# Altium schematic sheet BRAWN.SchDoc: Top Level
size A3; CompanyName: NOT USED; SheetNumber: 0; SheetTotal: 0; PageSetup: Record=PageOptions|CenterHorizontal=True|CenterVertical=True|PrintScale=1.00|XCorrection=1.00|YCorrection=1.00|PrintKind=0|BorderSize=5000000|LeftOffset=0|BottomOffset=0|Orientation=2|PaperLength=1000|PaperWidth=1000|Scale=100|PaperSource=7|PrintQuality=-4|MediaType=1|DitherType=10|PaperKind=A3|PrintScaleMode=0
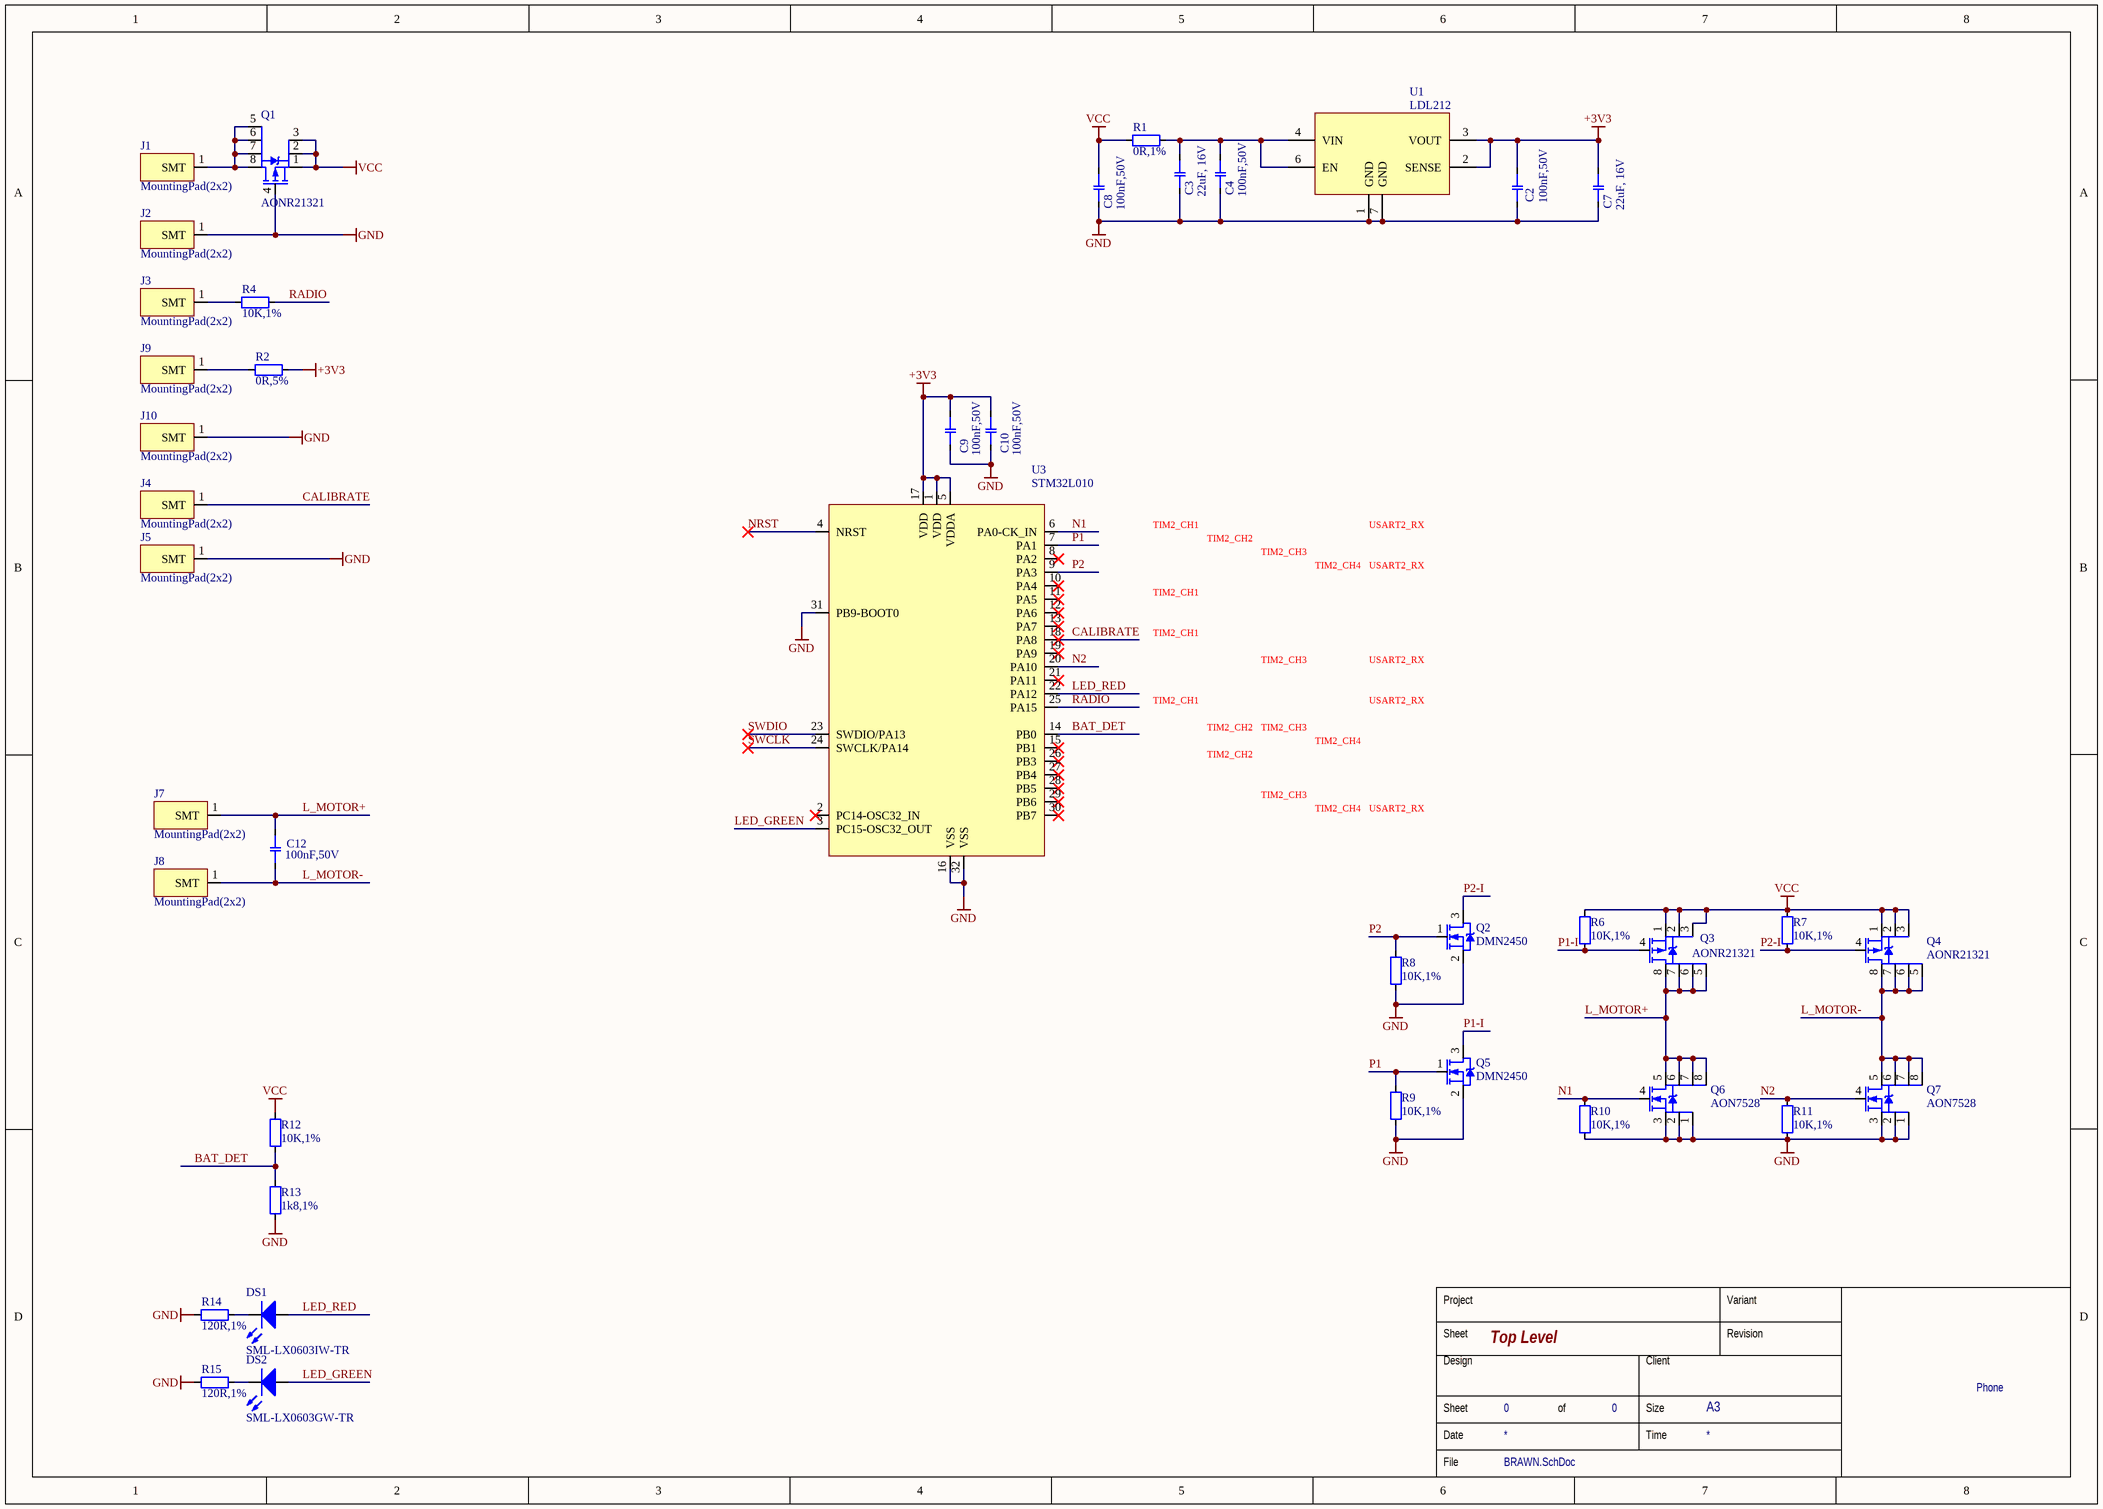
[diagram p0: BRAWN.SchDoc]

## Parts
C2  100nF,50V  [CAPC1005X05N_0402]
C3  22uF, 16V  [CAPC2012X12N_0805]
C4  100nF,50V  [CAPC1005X05N_0402]
C7  22uF, 16V  [CAPC2012X12N_0805]
C8  100nF,50V  [CAPC1005X05N_0402]
C9  100nF,50V  [CAPC1005X05N_0402]
C10  100nF,50V  [CAPC1005X05N_0402]
C12  100nF,50V  [CAPC1005X05N_0402]
DS1  SML-LX0603IW-TR  [LED_SML-LX0603]
DS2  SML-LX0603GW-TR  [LED_SML-LX0603]
J1  MountingPad(2x2)  [MountingPad(2x2)]
J2  MountingPad(2x2)  [MountingPad(2x2)]
J3  MountingPad(2x2)  [MountingPad(2x2)]
J4  MountingPad(2x2)  [MountingPad(2x2)]
J5  MountingPad(2x2)  [MountingPad(2x2)]
J7  MountingPad(2x2)  [MountingPad(2x2)]
J8  MountingPad(2x2)  [MountingPad(2x2)]
J9  MountingPad(2x2)  [MountingPad(2x2)]
J10  MountingPad(2x2)  [MountingPad(2x2)]
Q1  AONR21321  [DFN3X3A_8L_EP1_P]
Q2  DMN2450  [DFN3-125x125x53]
Q3  AONR21321  [DFN3X3A_8L_EP1_P]
Q4  AONR21321  [DFN3X3A_8L_EP1_P]
Q5  DMN2450  [DFN3-125x125x53]
Q6  AON7528  [DFN3X3A_8L_EP1_P]
Q7  AON7528  [DFN3X3A_8L_EP1_P]
R1  0R,1%  [RESC1005X04N_0402]
R2  0R,5%  [RESC1608X06N_0603]
R4  10K,1%  [RESC1005X04N_0402]
R6  10K,1%  [RESC1005X04N_0402]
R7  10K,1%  [RESC1005X04N_0402]
R8  10K,1%  [RESC1005X04N_0402]
R9  10K,1%  [RESC1005X04N_0402]
R10  10K,1%  [RESC1005X04N_0402]
R11  10K,1%  [RESC1005X04N_0402]
R12  10K,1%  [RESC1005X04N_0402]
R13  1k8,1%  [RESC1005X04N_0402]
R14  120R,1%  [RESC1005X04N_0402]
R15  120R,1%  [RESC1005X04N_0402]
U1  LDL212  [DFN50P200X200X80-8N_PWSON6]
U3  STM32L010  [TSQFP50P700X700X160-32N]

## Nets
+3V3: C2.2 C7.2 C9.2 C10.2 R2.2 U1.2(SENSE) U1.3(VOUT) U3.1(VDD) U3.5(VDDA) U3.17(VDD)
GND: C2.1 C3.1 C4.1 C7.1 C8.1 C9.1 C10.1 J2.1(SMT) J5.1(SMT) J10.1(SMT) Q1.4(G) Q2.2(S) Q5.2(S) Q6.1(S) Q6.2(S) Q6.3(S) Q7.1(S) Q7.2(S) Q7.3(S) R8.2 R9.2 R10.2 R11.2 R13.2 R14.1 R15.1 U1.1(GND) U1.7(GND) U3.16(VSS) U3.31(PB9-BOOT0) U3.32(VSS)
VCC: C8.2 Q1.1(S) Q1.2(S) Q1.3(S) Q3.1(S) Q3.2(S) Q3.3(S) Q4.1(S) Q4.2(S) Q4.3(S) R1.1 R6.1 R7.1 R12.1
BAT_DET: R12.2 R13.1 U3.14(PB0)
CALIBRATE: J4.1(SMT) U3.18(PA8)
L_MOTOR+: C12.2 J7.1(SMT) Q3.5(D) Q3.6(D) Q3.7(D) Q3.8(D) Q6.5(D) Q6.6(D) Q6.7(D) Q6.8(D)
L_MOTOR-: C12.1 J8.1(SMT) Q4.5(D) Q4.6(D) Q4.7(D) Q4.8(D) Q7.5(D) Q7.6(D) Q7.7(D) Q7.8(D)
LED_GREEN: DS2.2(A) U3.3(PC15-OSC32_OUT)
LED_RED: DS1.2(A) U3.22(PA12)
N1: Q6.4(G) R10.1 U3.6(PA0-CK_IN)
N2: Q7.4(G) R11.1 U3.20(PA10)
NRST: U3.4(NRST)
P1: Q5.1(G) R9.1 U3.7(PA1)
P1-I: Q3.4(G) Q5.3(D) R6.2
P2: Q2.1(G) R8.1 U3.9(PA3)
P2-I: Q2.3(D) Q4.4(G) R7.2
RADIO: R4.2 U3.25(PA15)
SWCLK: U3.24(SWCLK/PA14)
SWDIO: U3.23(SWDIO/PA13)
NetC3_2: C3.2 C4.2 R1.2 U1.4(VIN) U1.6(EN)
NetDS1_1: DS1.1(C) R14.2
NetDS2_1: DS2.1(C) R15.2
NetJ1_1: J1.1(SMT) Q1.5(D) Q1.6(D) Q1.7(D) Q1.8(D)
NetJ3_1: J3.1(SMT) R4.1
NetJ9_1: J9.1(SMT) R2.1

Not connected (* = marked no-connect by the designer): U3 2(PC14-OSC32_IN)* 8(PA2)* 10(PA4)* 11(PA5)* 12(PA6)* 13(PA7)* 15(PB1)* 19(PA9)* 21(PA11)* 26(PB3)* 27(PB4)* 28(PB5)* 29(PB6)* 30(PB7)*

## Notes on the sheet
- TIM2_CH1
- TIM2_CH2
- TIM2_CH3
- TIM2_CH4
- USART2_RX
- Project
- Variant
- Sheet
- Design
- Client
- Revision
- Phone
- Date
- of
- Size
- Time
- A3
- File

## Library data of the parts
C2 C4 C8-C10 C12 = CCG-104CE-G: CAP CER 100nF 50V X7R 0402; Manufacturer: Taiyo Yuden; Manufacturer Part Number: UMK105B7104KV-FR; Tolerance: 10%; Type: Ceramic; Display_Name: 100nF,50V; Capacitance: 100nF; Dielectric: X7R; Voltage: 50V; BWA PN: CCG-104CE-G; Schematic Symbol: CAP-NP_1; Supplier 1: Digi-Key; Supplier Part Number 1: 587-3498-1-ND
C3 C7 = CCI-226DE-G: CAP CER 22UF 16V X5R 0805; Manufacturer: Samsung Electro-Mechanics; Manufacturer Part Number: CL21A226KOQNNNE; Tolerance: 10%; Type: Ceramic; Display_Name: 22uF, 16V; Capacitance: 22uF; Dielectric: X5R; Voltage: 16V; BWA PN: CCI-226DE-G; Schematic Symbol: CAP-NP_1; Supplier 1: Digi-Key; Supplier Part Number 1: 1276-6526-1-ND
DS1 = LED-10056-A: LED 635NM RED DIFF 0603 SMD; Manufacturer: Lumex Opto/Components Inc; Axial Intensity: 14mcd; If(max): 20mA; Lens type: Diffused, White; Lens Style/Size: Rectangle, 1mmx0.8mm; Vf@I: 2V; Viewing Angle: 160deg; Vr(max): 5V; Display_Name: SML-LX0603IW-TR; Wavelength: 635nm; BWA PN: LED-10056-A; Colour: Red; Schematic Symbol: LED_1; Manufacturer Part Number: SML-LX0603IW-TR; Supplier 1: Digi-Key; Supplier Part Number 1: 67-1548-1-ND
DS2 = LED-10011-A: LED 565NM GRN DIFF 0603 SMD; Manufacturer: Lumex Opto/Components Inc; Axial Intensity: 18mcd; Colour: Green; If(max): 25mA; Lens type: Diffused, White; Lens Style/Size: Rectangle, 1mmx0.8mm; Vf@I: 2.2V; Viewing Angle: 160deg; Vr(max): 5V; Display_Name: SML-LX0603GW-TR; Wavelength: 565nm; BWA PN: LED-10011-A; Schematic Symbol: LED_1; Manufacturer Part Number: SML-LX0603GW-TR; Supplier 1: Digi-Key; Supplier Part Number 1: 67-1549-1-ND
Q1 Q3 Q4 = TRN-10126-A: P-Channel 30 V 24A (Tc) 4.1W (Ta), 24W (Tc) Surface Mount 8-DFN-EP (3x3); Manufacturer: Alpha & Omega Semiconductor Inc.; Type: P; rds(on): 16.5mOhm @ 12A, 10V; Vds(max): 30V; Vgs(max): ±25V; Vth(max): 2.3V @ 250µA; Display_Name: AONR21321; BWA PN: TRN-10126-A; Id(max): 24A; Schematic Symbol: MOSFET-P_5; Manufacturer Part Number: AONR21321; Supplier 1: Digi-Key; Supplier Part Number 1: 785-1797-1-ND
Q2 Q5 = TRN-10128-P: MOSFET N-CH 20V 900MA 3DFN; Manufacturer: Diodes Incorporated; Manufacturer Part Number: DMN2450UFD-7; Type: N; rds(on): 600mOhm @ 200mA, 4.5V; Vgs(max): ±12V; Vth(max): 1V @ 250µA; Display_Name: DMN2450; BWA PN: TRN-10128-P; Id(max): 900mA; Vds(max): 20V; Schematic Symbol: MOSFET-N_1; Supplier 1: Digi-Key; Supplier Part Number 1: DMN2450UFD-7DICT-ND
Q6 Q7 = TRN-10127-A: MOSFET N-CH 30V 45A/50A 8DFN; Manufacturer: Alpha & Omega Semiconductor Inc.; Type: N; Id(max): 40A; rds(on): 2mOhm @ 20A, 10V; Vgs(max): ±20V; Vth(max): 2.2V @ 250µA; Display_Name: AON7528; BWA PN: TRN-10127-A; Vds(max): 30V; Schematic Symbol: MOSFET-N_5; Manufacturer Part Number: AON7528; Supplier 1: Digi-Key; Supplier Part Number 1: 785-1506-1-ND
R1 = RSG-0R000-F: RES 0R OHM 1/16W 5% 0402 SMD; Manufacturer: Yageo; Manufacturer Part Number: RC0402JR-070RL; Power: 0.0625W; Display_Name: 0R,1%; Resistance: 0R; Tolerance: 5%; Type: Chip; BWA PN: RSG-0R000-F; Schematic Symbol: RESISTOR_1; Supplier 1: Digi-Key; Supplier Part Number 1: 311-0.0JRCT-ND
R2 = RSH-0R000-F: RES 0.0 OHM 1/10W 0603 SMD; Manufacturer: Yageo; Manufacturer Part Number: RC0603JR-070RL; Power: 0.1W; Display_Name: 0R,5%; Resistance: 0R; Tolerance: 5%; Type: Chip; BWA PN: RSH-0R000-F; Schematic Symbol: RESISTOR_1; Supplier 1: Digi-Key; Supplier Part Number 1: 311-0.0GRCT-ND
R4 R6-R12 = RSG-10K00-D: RES 10K OHM 1/16W 1% 0402 SMD; Manufacturer: Yageo; Manufacturer Part Number: RC0402FR-0710KL; Power: 0.0625W; Display_Name: 10K,1%; Resistance: 10K; Tolerance: 1%; Type: Chip; BWA PN: RSG-10K00-D; Schematic Symbol: RESISTOR_1; Supplier 1: Digi-Key; Supplier Part Number 1: 311-10.0KLRCT-ND
R13 = RSG-1K800-D: RES 1k8 0.0625W 1% 0402 SMD; Manufacturer: Vishay Dale; Manufacturer Part Number: CRCW04021K80FKED; Display_Name: 1k8,1%; Power: 0.0625W; Resistance: 1k8; Tolerance: 1%; Type: Chip; BWA PN: RSG-1K800-D; Schematic Symbol: RESISTOR_1; Supplier 1: Digi-Key; Supplier Part Number 1: 541-1.80KLCT-ND
R14 R15 = RSG-120R0-D: RES 120 OHM 1/16W 0402 SMD; Manufacturer: Yageo; Manufacturer Part Number: RC0402FR-07120RL; Power: 0.0625W; Display_Name: 120R,1%; Resistance: 120R; Tolerance: 1%; Type: Chip; BWA PN: RSG-120R0-D; Schematic Symbol: RESISTOR_1; Supplier 1: Digi-Key; Supplier Part Number 1: 311-120LRCT-ND
U1 = ICT-10916-A: 1.2A 3V3 LDO LINEAR REGULATOR; Manufacturer: STMicroelectronics; Manufacturer Part Number: LDL212PV33R; Temp Range: -40°C ~ 125°C (TJ); Display_Name: LDL212; BWA PN: ICT-10916-A; Schematic Symbol: LDL212PU50R; Supplier 1: Digi-Key; Supplier Part Number 1: 497-19548-1-ND
U3 = ICT-10946-A: ARM® Cortex®-M0+ series Microcontroller IC 32-Bit 32MHz 16KB (16K x 8) FLASH 32-LQFP (7x7); Manufacturer: STMicroelectronics; Manufacturer Part Number: STM32L010K4T6; Temp Range: -40°C ~ 85°C (TA); Display_Name: STM32L010; BWA PN: ICT-10946-A; Schematic Symbol: STM32L010F4/K4; Supplier 1: Digi-Key; Supplier Part Number 1: 497-STM32L010K4T6-ND